# Altium schematic sheet RFID Reader MCU.SchDoc
size A3; SheetNumber: 6; SheetTotal: 8
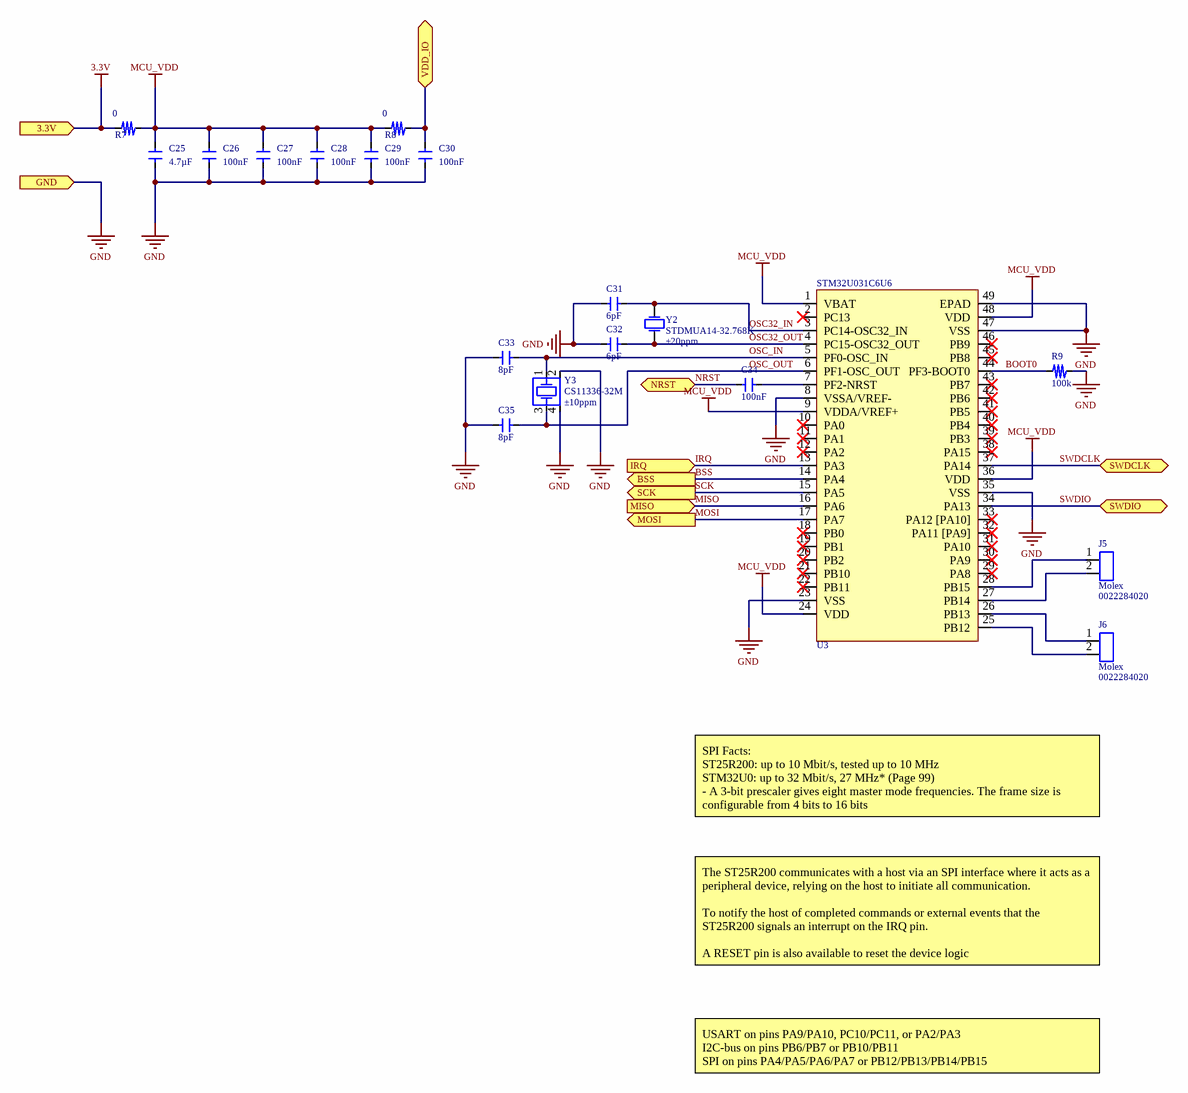
[diagram p0: RFID Reader MCU.SchDoc]

## Parts
?  (no value)  (graphical)
C25  value 4.7µF  [SYK-STD-CAP-0603]  (hidden comment: C1608X7S1A475K080AC)
C26  value 100nF  [SYK-STD-CAP-0402]  (hidden comment: C1005X7R1H104K050BE)
C27  value 100nF  [SYK-STD-CAP-0402]  (hidden comment: C1005X7R1H104K050BE)
C28  value 100nF  [SYK-STD-CAP-0402]  (hidden comment: C1005X7R1H104K050BE)
C29  value 100nF  [SYK-STD-CAP-0402]  (hidden comment: C1005X7R1H104K050BE)
C30  value 100nF  [SYK-STD-CAP-0402]  (hidden comment: C1005X7R1H104K050BE)
C31  value 6pF  [SYK-STD-CAP-0201]  (hidden comment: GRM0335C1H6R0BA01D)
C32  value 6pF  [SYK-STD-CAP-0201]  (hidden comment: GRM0335C1H6R0BA01D)
C33  value 8pF  [SYK-STD-CAP-0201]  (hidden comment: GRM0335C1H8R0BA01D)
C34  value 100nF  [SYK-STD-CAP-0402]  (hidden comment: C1005X7R1H104K050BE)
C35  value 8pF  [SYK-STD-CAP-0201]  (hidden comment: GRM0335C1H8R0BA01D)
J5  Manufacturer: Molex  [0022284020]  (hidden comment: 0022284020)
J6  Manufacturer: Molex  [0022284020]  (hidden comment: 0022284020)
R7  value 0  [SYK-STD-RES-0603]  (hidden comment: ERJ3GEY0R00V)
R8  value 0  [SYK-STD-RES-0603]  (hidden comment: ERJ3GEY0R00V)
R9  value 100k  [SYK-STD-RES-0603]  (hidden comment: SYK-RES-GEN-100k-5%-0.1W-0603)
U3  STM32U031C6U6  [ST MICRO UFQFPN48]
Y2  Frequency Tolerance: ±20ppm  [NDK 2-SMD]  (hidden comment: STDMUA14-32.768K)
Y3  Frequency Stability: ±10ppm  [NDK 4-SMD]  (hidden comment: CS11336-32M)

## Ports
3.3V (in), BSS (out), GND (in), IRQ (in), MISO (in), MOSI (out), NRST (bidir), SCK (out), SWDCLK (bidir), SWDIO (bidir), VDD_IO (bidir)

## Nets
3.3V: R7.2 ; port 3.3V
GND: C25.1 C26.1 C27.1 C28.1 C29.1 C30.1 C31.1 C32.1 C33.1 C35.1 R9.1 U3.8(VSSA/VREF-) U3.23(VSS) U3.35(VSS) U3.47(VSS) U3.49(EPAD) Y3.2 Y3.4 ; port GND
MCU_VDD: C25.2 C26.2 C27.2 C28.2 C29.2 R7.1 R8.2 U3.1(VBAT) U3.9(VDDA/VREF+) U3.24(VDD) U3.36(VDD) U3.48(VDD)
BOOT0: R9.2 U3.44(PF3-BOOT0)
BSS: U3.14(PA4) ; port BSS
IRQ: U3.13(PA3) ; port IRQ
MISO: U3.16(PA6) ; port MISO
MOSI: U3.17(PA7) ; port MOSI
NRST: C34.2 ; port NRST
OSC32_IN: C31.2 U3.3(PC14-OSC32_IN) Y2.1
OSC32_OUT: C32.2 U3.4(PC15-OSC32_OUT) Y2.2
OSC_IN: C33.2 U3.5(PF0-OSC_IN) Y3.1
OSC_OUT: C35.2 U3.6(PF1-OSC_OUT) Y3.3
SCK: U3.15(PA5) ; port SCK
SWDCLK: U3.37(PA14) ; port SWDCLK
SWDIO: U3.34(PA13) ; port SWDIO
VDD_IO: C30.2 R8.1 ; port VDD_IO
NetC34_1: C34.1 U3.7(PF2-NRST)
NetJ5_1: J5.1 U3.28(PB15)
NetJ5_2: J5.2 U3.27(PB14)
NetJ6_1: J6.1 U3.26(PB13)
NetJ6_2: J6.2 U3.25(PB12)

Not connected (* = marked no-connect by the designer): U3 2(PC13)* 10(PA0)* 11(PA1)* 12(PA2)* 18(PB0)* 19(PB1)* 20(PB2)* 21(PB10)* 22(PB11)* 29(PA8)* 30(PA9)* 31(PA10)* 32(PA11_[PA9])* 33(PA12_[PA10])* 38(PA15)* 39(PB3)* 40(PB4)* 41(PB5)* 42(PB6)* 43(PB7)* 45(PB8)* 46(PB9)*

## Notes on the sheet
- SPI Facts:
  ST25R200: up to 10 Mbit/s, tested up to 10 MHz
  STM32U0: up to 32 Mbit/s, 27 MHz* (Page 99)
  - A 3-bit prescaler gives eight master mode frequencies. The frame size is configurable from 4 bits to 16 bits
- The ST25R200 communicates with a host via an SPI interface where it acts as a peripheral device, relying on the host to initiate all communication.
  To notify the host of completed commands or external events that the ST25R200 signals an interrupt on the IRQ pin.
  A RESET pin is also available to reset the device logic
- USART on pins PA9/PA10, PC10/PC11, or PA2/PA3
  I2C-bus on pins PB6/PB7 or PB10/PB11
  SPI on pins PA4/PA5/PA6/PA7 or PB12/PB13/PB14/PB15
- LAYER NAME
- CRITICAL QUALITY ATTRIBUTE
- TITLE NAME
- THIS DRAWING CONTAINS CONFIDENTIAL INFORMATION AND IS ISSUED IN CONFIDENCE ON THE CONDITIONS
  THAT IT BE RETURNED ON DEMAND AND NOT BE COPIED, REPRODUCED, DISCLOSED TO OTHERS OR USED
  IN THE MANUFACTURE OF THE SUBJECT-MATTER THEREOF WITHOUT THE WRITTEN CONSENT OF
  STRYKER CORPORATION.
- SHALL BE COMPLIANT PER ES-1168 AND ES-1005
- SHEET
- OF
- NUMBER
- REV
- APPROVALS ARE FOUND IN PLM SYSTEM

## Library data of the parts
? = CMP-001-0000-v0.01.17: Stryker standard title block with pre-parameterized fields
C25 = CMP-001-0260-v0.01.01: CAP CER 4.7UF 10V X7S 0603; Manufacturer: TDK Corporation; Device Length: 1.6mm; Tolerance: 10%; Capacitor Type: Ceramic; Device Width: 800µm; Device Height: 1mm; Style Guide Revision: Librarian to Review; Temperature Coefficient: X7S; Case/Package: 0603 (1608 Metric); Critical Component: -; Ratings: -; Moisture Sensitivity Level: 1; Voltage Rating: 10V; RoHS Compliant: Yes; Pins: 2; Operating Temperature - Max: 125°C; Features: Low ESL; Operating Temperature - Min: -55°C; Mounting Technology: SMT; REACH Compliant: Unaffected; Manufacturer Part Number: C1608X7S1A475K080AC
C26-C30 C34 = CMP-001-0107-v0.01.03: CAP CER 0.1uF 50V X7R 10% 0402; Manufacturer: TDK; Device Length: 1mm; Device Width: 500µm; Capacitor Type: Ceramic; CLASS: DISCRETE; Device Height: 600µm; Style Guide Revision: AA; Request Item Number: 558;M103;1418; Repetitive Reverse Voltage Maximum: Yes; Operating Temperature - Max: 125°C; Rated Voltage: 50V; Datasheet: https://product.tdk.com/info/en/catalog/datasheets/mlcc_commercial_soft_en.pdf; Critical Component: -; Component Type: Standard; Dielectric Type: Ceramic; Operating Temperature - Min: -55°C; REACH Compliant: Unknown; Mounting Technology: SMT; Tolerance: 10%; Moisture Sensitivity Level: Unknown; Temperature Coefficient: X7R; Pins: 2; Voltage Rating: 50V; Case/Package: 0402; Manufacturer Part Number: C1005X7R1H104K050BE; RoHS Compliant: Yes; Ratings: -
C31 C32 = CMP-001-0297-v0.01.00: CAP CER 6PF 50V C0G/NP0 0201; Manufacturer: Murata Electronics; Device Length: 600µm; Style Guide Revision: Librarian to Review; Device Height: 300µm; Capacitor Type: Ceramic; Temperature Coefficient: C0G, NP0; Tolerance: 0.1%; Manufacturer Part Number: GRM0335C1H6R0BA01D; Critical Component: -; Operating Temperature - Min: -55°C; Pins: 2; RoHS Compliant: Yes; Moisture Sensitivity Level: 1; Device Width: 300µm; Operating Temperature - Max: 125°C; Voltage Rating: 50V; Mounting Technology: Surface Mount; Ratings: -; REACH Compliant: Unaffected; Case/Package: 0201 (0603 Metric)
C33 C35 = CMP-001-0296-v0.01.00: CAP CER 8PF 50V C0G/NP0 0201; Manufacturer: Murata Electronics; Device Length: 600µm; Tolerance: 0.1%; Capacitor Type: Ceramic; Device Height: 300µm; Style Guide Revision: Librarian to Review; Temperature Coefficient: C0G, NP0; Case/Package: 0201 (0603 Metric); Ratings: -; Critical Component: -; Mounting Technology: Surface Mount; Moisture Sensitivity Level: 1; REACH Compliant: Unaffected; Operating Temperature - Max: 125°C; RoHS Compliant: Yes; Operating Temperature - Min: -55°C; Manufacturer Part Number: GRM0335C1H8R0BA01D; Voltage Rating: 50V; Device Width: 300µm; Pins: 2
J5 J6 = CMP-00014-v0.01.04: Board Connector, 2 Contact(s), 1 Row(s), Male, Straight, Solder Terminal; Manufacturer Series: 42375; MIL Conformance: No; Style Guide Revision: Librarian to Review; Contact Current Rating - Max: 4A; Device Length: 5.08mm; Material Flammability Rating: 94V-0; Device Width: 2.49mm; Pitch - Mating: 2.54mm; Connector Style: Other; Voltage Rating: 500V; Rows: 1; Connector Type: Header; Device Height: 7.75mm; Mating Connector: multiple; Option: General Purpose; Contact Material: Brass; Mount: Board; System: Connector; Contact Finish - Mating: Tin; RoHS Compliant: Yes; IEC Conformance: No; Mounting Technology: PTH; Insulation Color: Black; Orientation: Vertical; Critical Component: -; Insulation Material: High Temperature Thermoplastic; Mixed Contacts: No; DIN Conformance: No; Gender: Male; JESD-609 Code: e3; Contact Finish - Termination: Tin (Sn) - with Nickel (Ni) barrier; Contact Finish - Mounting: Tin; Filter Feature: No; Manufacturer Part Number: 0022284020; Operating Temperature - Min: -40°C; Contact Finish Thickness - Mating: 2.54µm; Features: Breakaway; Contact Gender: Male; REACH Compliant: Unaffected; Pins: 2; Operating Temperature - Max: 80°C; Termination: Solder; Terminal Pitch: 2.54mm
R7 R8 = CMP-001-0150-v0.01.08: RES SMD 0 OHM JUMPER 1/10W 0603; Manufacturer: PANASONIC (GENERIC); Style Guide Revision: AA; Device Width: 500µm; Tolerance: 0%; Power: 100mW; Device Length: 1mm; Device Height: 400µm; Operating Temperature - Max: 155°C; Manufacturer Part Number: ERJ3GEY0R00V; REACH Compliant: Unaffected; Mounting Technology: SMT; Pin Count: 2; Temperature Coefficient: -; Critical Component: -; Case/Package: 0603; Operating Temperature - Min: -55°C; RoHS Compliant: Yes
R9 = CMP-00209-v0.01.07: Fixed Resistor, Metal Glaze/thick Film, 0.1W, 100000ohm, 75V, 5% +/-Tol, 200ppm/Cel, Surface Mount, 0603; Manufacturer: Generic; Temperature Coefficient: 200ppm/°C; Device Width: 850µm; Style Guide Revision: Librarian to Review; Device Height: 450µm; Device Length: 1.6mm; Power: 100mW; Mounting Technology: SMT; Voltage Rating: 75V; Operating Temperature - Min: -55°C; RoHS Compliant: Yes; REACH Compliant: Unaffected; Operating Temperature - Max: 155°C; Tolerance: 5%; Critical Component: -; Pin Count: 2; Case/Package: 0603; Manufacturer Part Number: Generic
U3 = CMP-001-0761-v0.01.01: IC MCU 32BIT 32KB FLASH 48UFQFPN; Manufacturer: STMicroelectronics; Device Height: 600µm; Voltage - Supply (Max): 3.6V; Device Width: 7.1mm; Voltage - Supply (Min): 1.71V; Style Guide Revision: Librarian to Review; Pin Count: 49; Case/Package: 48UFQFPN; RoHS Compliant: Yes; Operating Temperature - Max: 85°C; Device Length: 7.1mm; Critical Component: -; REACH Compliant: Unaffected; Manufacturer Part Number: STM32U031C6U6; Operating Temperature - Min: -40°C; Mounting Technology: SMT
Y2 = CMP-001-0298-v0.01.02: Crystal 32.7680KHZ 6PF SMD; Manufacturer: NDK America, Inc.; Frequency: 32.768kHz; ESR: 70k; Device Length: 3.20mm; Style Guide Revision: Librarian to Review; Device Width: 1.50mm; Device Height: 0.90mm; Mounting Technology: SMT; Operating Temperature - Min: -40°C; Crystal Type: Crystal; Critical Component: -; Manufacturer Part Number: STDMUA14-32.768K; Capacitance-  Load: 6pF; REACH Compliant: Unknown; RoHS Compliant: Unknown; Pin Count: 2; Moisture Sensitivity Level: 1; Operating Temperature - Max: 85°C; Case/Package: 2-SMD, No Lead
Y3 = CMP-001-0275-v0.01.03: CRYSTAL 32.0000MHZ 8PF SMD; Manufacturer: NDK America, Inc.; ESR: 60; Crystal Oscillation Mode: Fundamental; Frequency: 32MHz; Device Width: 1.60mm; Style Guide Revision: Librarian to Review; Device Height: 0.50mm; Device Length: 2.00mm; Operating Temperature - Min: -20°C; Critical Component: -; Mounting Technology: SMT; Case/Package: 4-SMD, No Lead; RoHS Compliant: Yes; Crystal Type: Crystal; Manufacturer Part Number: CS11336-32M; REACH Compliant: Unaffected; Frequency Tolerance: ±10ppm; Operating Temperature - Max: 70°C; Capacitance-  Load: 8pF; Pin Count: 4